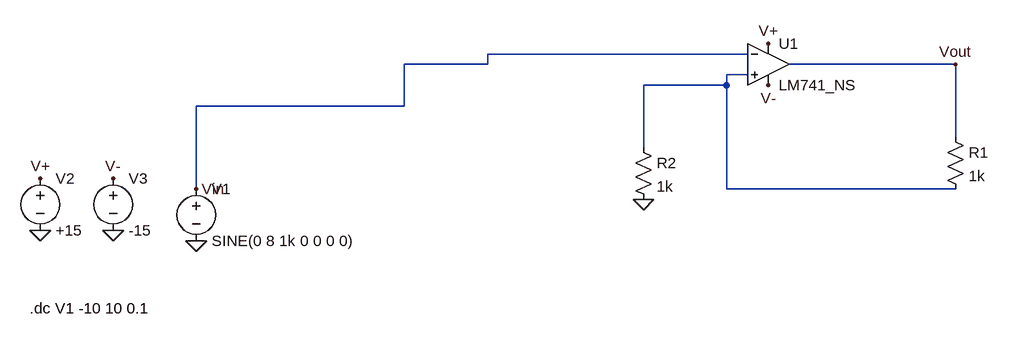
[diagram p0: schematic q2.asc]
q2.asc, the LTspice schematic file:
Version 4
SHEET 1 880 680
WIRE 160 112 -240 112
WIRE -240 128 -240 112
WIRE -240 128 -368 128
WIRE 480 128 224 128
WIRE 160 144 128 144
WIRE 128 160 128 144
WIRE 128 160 0 160
WIRE -368 192 -368 128
WIRE -368 192 -688 192
WIRE 480 240 480 128
WIRE 0 256 0 160
WIRE -688 320 -688 192
WIRE 128 320 128 160
WIRE 480 320 128 320
FLAG -688 400 0
FLAG -816 384 0
FLAG -928 384 0
FLAG -688 320 Vin
FLAG -928 304 V+
FLAG -816 304 V-
FLAG 192 96 V+
FLAG 192 160 V-
FLAG 0 336 0
FLAG 480 128 Vout
DATAFLAG -688 320 ""
SYMBOL AutoGenerated\\LM741_NS 192 64 R0
SYMATTR InstName U1
SYMBOL voltage -688 304 R0
WINDOW 123 0 0 Left 2
WINDOW 39 0 0 Left 2
SYMATTR InstName V1
SYMATTR Value SINE(0 8 1k 0 0 0 0)
SYMBOL voltage -928 288 R0
WINDOW 123 0 0 Left 2
WINDOW 39 0 0 Left 2
SYMATTR InstName V2
SYMATTR Value +15
SYMBOL voltage -816 288 R0
WINDOW 123 0 0 Left 2
WINDOW 39 0 0 Left 2
SYMATTR InstName V3
SYMATTR Value -15
SYMBOL res 464 224 R0
SYMATTR InstName R1
SYMATTR Value 1k
SYMBOL res -16 240 R0
SYMATTR InstName R2
SYMATTR Value 1k
TEXT -944 504 Left 2 !.dc V1 -10 10 0.1

The netlist it stands for:
* q2.asc
* U1: LM741_NS (symbol AutoGenerated\LM741_NS not available, pins judged from their places): In+=N001 In-=Vin V+=V+ V-=V- OUT=Vout
V1 Vin 0 SINE(0 8 1k 0 0 0 0)
V2 V+ 0 +15
V3 V- 0 -15
R1 Vout N001 1k
R2 N001 0 1k
.dc V1 -10 10 0.1
.backanno
.end